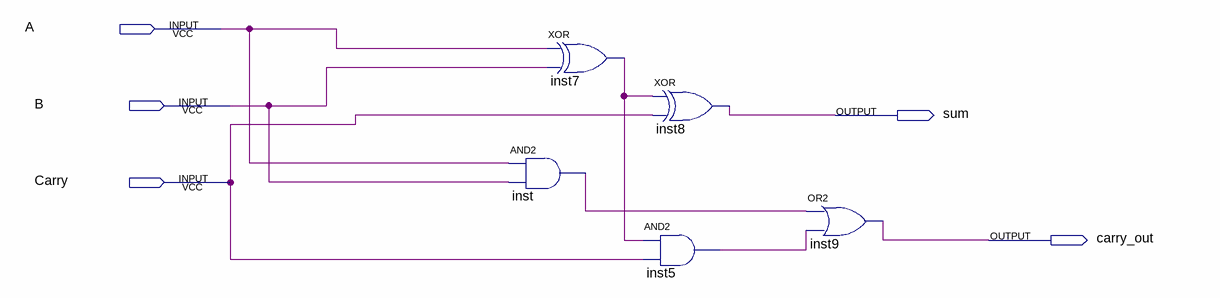
[diagram p0: schematic sheet]
// Quartus schematic Week1.bdf as structural Verilog: 5 symbols, 5 pins
module Week1 (
  input  A,
  input  B,
  input  Carry,
  output sum,
  output carry_out
);

  wire inst5_out, inst7_out, inst_out;

  xor inst7 (inst7_out, A, B);
  and inst (inst_out, A, B);
  xor inst8 (sum, inst7_out, Carry);
  and inst5 (inst5_out, inst7_out, Carry);
  or inst9 (carry_out, inst_out, inst5_out);
endmodule
